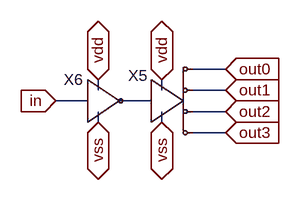
[diagram p0: schematic 1_to_4_buffer.asc]
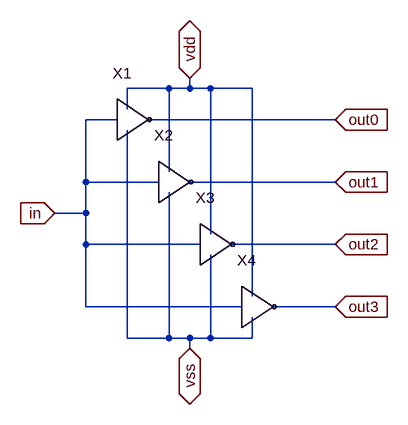
[diagram p1: sub-circuit 1_to_4_not.asc]
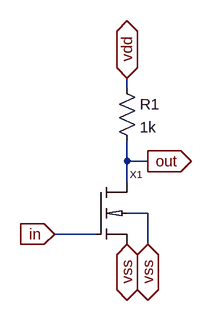
[diagram p2: sub-circuit not.asc]
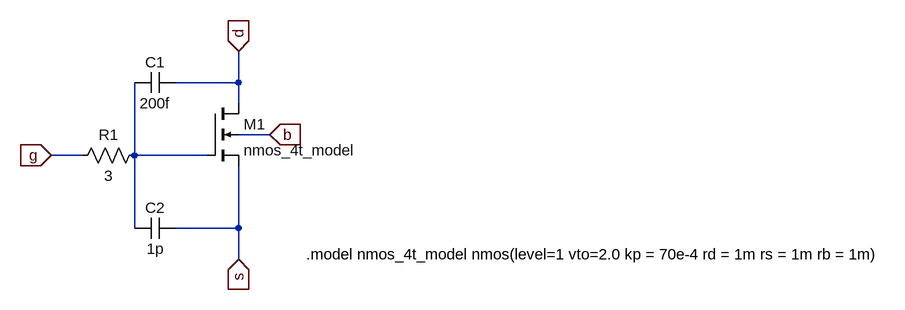
[diagram p3: sub-circuit nmos_4t.asc]
1_to_4_buffer.asc, the LTspice schematic file:
Version 4
SHEET 1 880 680
WIRE -96 128 -144 128
WIRE -288 160 -288 144
WIRE -192 160 -192 144
WIRE -96 160 -144 160
WIRE -304 176 -352 176
WIRE -208 176 -256 176
WIRE -96 192 -144 192
WIRE -288 208 -288 192
WIRE -192 208 -192 192
WIRE -96 224 -144 224
FLAG -352 176 in
IOPIN -352 176 In
FLAG -96 128 out0
IOPIN -96 128 In
FLAG -96 160 out1
IOPIN -96 160 In
FLAG -96 192 out2
IOPIN -96 192 In
FLAG -96 224 out3
IOPIN -96 224 In
FLAG -192 144 vdd
IOPIN -192 144 BiDir
FLAG -192 208 vss
IOPIN -192 208 BiDir
FLAG -288 208 vss
IOPIN -288 208 BiDir
FLAG -288 144 vdd
IOPIN -288 144 BiDir
SYMBOL 1_to_4_not -192 176 R0
WINDOW 0 -36 -22 Bottom 2
SYMATTR InstName X5
SYMBOL not -304 176 R0
WINDOW 0 -21 -16 Bottom 2
SYMATTR InstName X6

1_to_4_not.asc, the sub-circuit schematic file:
Version 4
SHEET 1 880 680
WIRE 112 -16 48 -16
WIRE 144 -16 144 -32
WIRE 144 -16 112 -16
WIRE 176 -16 144 -16
WIRE 240 -16 176 -16
WIRE 48 16 48 -16
WIRE 32 32 -16 32
WIRE 368 32 80 32
WIRE 112 112 112 -16
WIRE -16 128 -16 32
WIRE 96 128 -16 128
WIRE 368 128 144 128
WIRE -16 176 -16 128
WIRE -16 176 -64 176
WIRE 176 208 176 -16
WIRE -16 224 -16 176
WIRE 160 224 -16 224
WIRE 368 224 208 224
WIRE 240 304 240 -16
WIRE -16 320 -16 224
WIRE 224 320 -16 320
WIRE 368 320 272 320
WIRE 48 368 48 48
WIRE 112 368 112 144
WIRE 112 368 48 368
WIRE 144 368 112 368
WIRE 176 368 176 240
WIRE 176 368 144 368
WIRE 240 368 240 336
WIRE 240 368 176 368
WIRE 144 384 144 368
FLAG -64 176 in
IOPIN -64 176 In
FLAG 368 32 out0
IOPIN 368 32 In
FLAG 368 128 out1
IOPIN 368 128 In
FLAG 368 224 out2
IOPIN 368 224 In
FLAG 368 320 out3
IOPIN 368 320 In
FLAG 144 384 vss
IOPIN 144 384 BiDir
FLAG 144 -32 vdd
IOPIN 144 -32 BiDir
SYMBOL not 32 32 R0
SYMATTR InstName X1
SYMBOL not 96 128 R0
SYMATTR InstName X2
SYMBOL not 160 224 R0
SYMATTR InstName X3
SYMBOL not 224 320 R0
SYMATTR InstName X4

not.asc, the sub-circuit schematic file:
Version 4
SHEET 1 880 680
WIRE 176 -96 176 -112
WIRE 176 16 176 -16
WIRE 208 16 176 16
WIRE 176 48 176 16
WIRE 208 96 176 96
WIRE 128 128 64 128
WIRE 208 144 208 96
FLAG 64 128 in
IOPIN 64 128 In
FLAG 176 144 vss
IOPIN 176 144 BiDir
FLAG 176 -112 vdd
IOPIN 176 -112 BiDir
FLAG 208 16 out
IOPIN 208 16 Out
FLAG 208 144 vss
IOPIN 208 144 BiDir
SYMBOL res 160 -112 R0
SYMATTR InstName R1
SYMATTR Value 1k
SYMBOL nmos_4t 128 48 R0
SYMATTR InstName X1

nmos_4t.asc, the sub-circuit schematic file:
Version 4
SHEET 1 880 680
WIRE -288 -224 -288 -272
WIRE -288 -224 -384 -224
WIRE -288 -192 -288 -224
WIRE -240 -144 -288 -144
WIRE -528 -112 -576 -112
WIRE -448 -112 -448 -224
WIRE -336 -112 -448 -112
WIRE -448 0 -448 -112
WIRE -288 0 -288 -96
WIRE -288 0 -384 0
WIRE -288 48 -288 0
FLAG -576 -112 g
IOPIN -576 -112 In
FLAG -288 -272 d
IOPIN -288 -272 In
FLAG -288 48 s
IOPIN -288 48 In
FLAG -240 -144 b
IOPIN -240 -144 In
SYMBOL nmos4 -336 -192 R0
SYMATTR InstName M1
SYMATTR Value nmos_4t_model
SYMBOL cap -384 -240 R90
WINDOW 0 0 32 VBottom 2
WINDOW 3 32 32 VTop 2
SYMATTR InstName C1
SYMATTR Value 200f
SYMBOL cap -384 -16 R90
WINDOW 0 0 32 VBottom 2
WINDOW 3 32 32 VTop 2
SYMATTR InstName C2
SYMATTR Value 1p
SYMBOL res -432 -128 R90
WINDOW 0 0 56 VBottom 2
WINDOW 3 32 56 VTop 2
SYMATTR InstName R1
SYMATTR Value 3
TEXT -184 40 Left 2 !.model nmos_4t_model nmos(level=1 vto=2.0 kp = 70e-4 rd = 1m rs = 1m rb = 1m)

The netlist it stands for:
* 1_to_4_buffer.asc
XX5 N001 out0 out1 out2 out3 vss vdd 1_to_4_not
XX6 in N001 vss vdd not

* block symbol definitions
.subckt 1_to_4_not in out0 out1 out2 out3 vss vdd
XX1 in out0 vss vdd not
XX2 in out1 vss vdd not
XX3 in out2 vss vdd not
XX4 in out3 vss vdd not
.ends 1_to_4_not

.subckt not in out vss vdd
R1 vdd out 1k
XX1 out in vss vss nmos_4t
.ends not

.subckt nmos_4t D G S B
M1 d N001 s b nmos_4t_model
C1 d N001 200f
C2 s N001 1p
R1 N001 g 3
.model nmos_4t_model nmos(level=1 vto=2.0 kp = 70e-4 rd = 1m rs = 1m rb = 1m)
.ends nmos_4t

.model NMOS NMOS
.model PMOS PMOS
.lib standard.mos
.backanno
.end